# Altium schematic sheet FRONT SENSORS.SchDoc
size A2
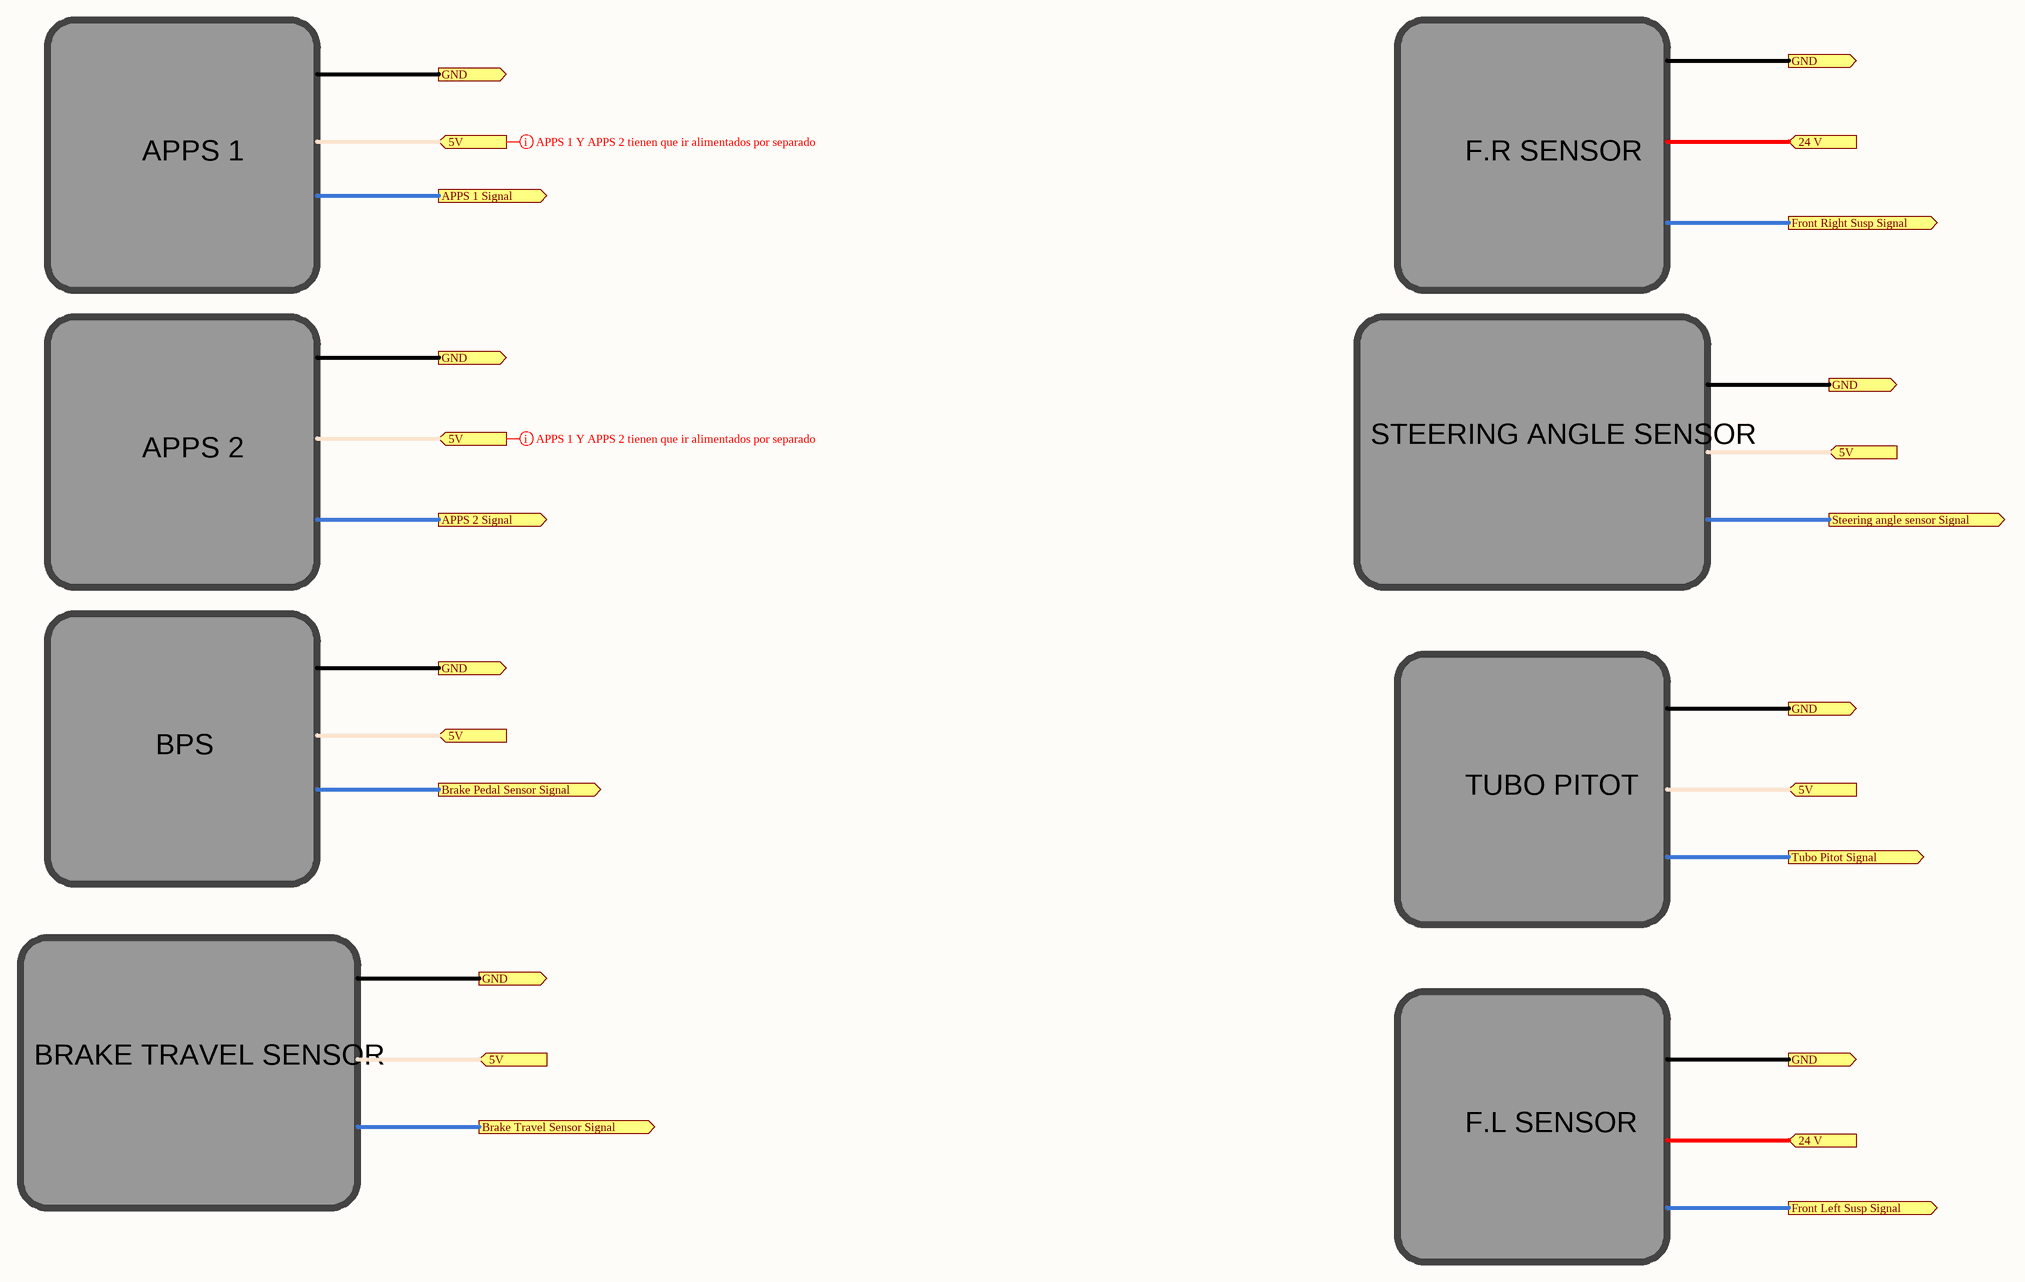
[diagram p0: FRONT SENSORS.SchDoc]

## Ports
5V (in), 24 V (in), APPS 1 Signal (out), APPS 2 Signal (out), Brake Pedal Sensor Signal (out), Brake Travel Sensor Signal (out), Front Left Susp Signal (out), Front Right Susp Signal (out), GND (out), Steering angle sensor Signal (out), Tubo Pitot Signal (out)

## Layout directives
mark named APPS 1 Y APPS 2 tienen que ir alimentados por separado: 5V

## Notes on the sheet
- APPS 1
- F.R SENSOR
- STEERING ANGLE SENSOR
- APPS 2
- BPS
- TUBO PITOT
- BRAKE TRAVEL SENSOR
- F.L SENSOR